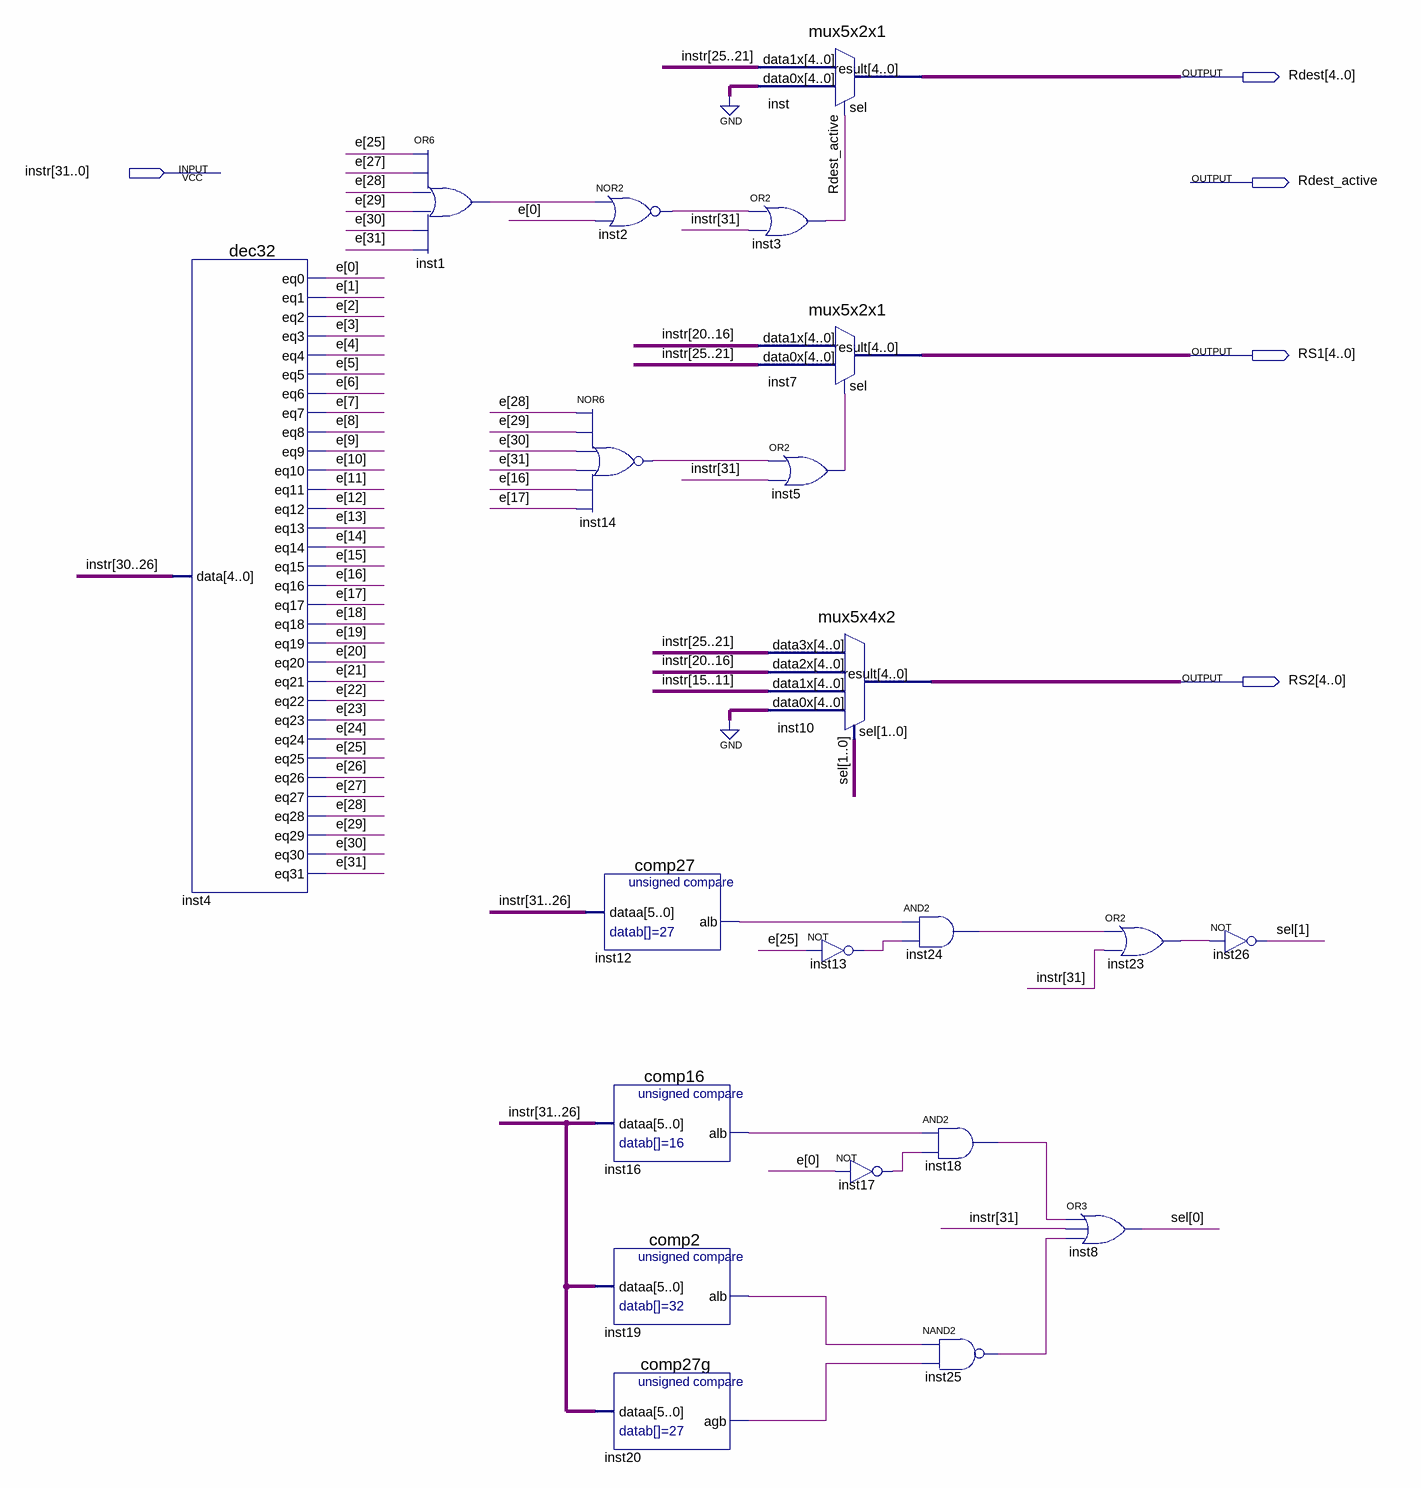
[diagram p0: schematic sheet]
// Quartus schematic RS_decode.bdf as structural Verilog: 21 symbols, 5 pins
module RS_decode (
  input  [31:0] instr,
  output [4:0] Rdest,
  output Rdest_active,
  output [4:0] RS1,
  output [4:0] RS2
);

  wire inst1_out, inst2_out, inst5_out, inst12_alb, inst13_out, inst14_out, inst16_alb, inst17_out,
       inst18_out, inst19_alb, inst20_agb, inst23_out, inst24_out, inst25_out;
  wire [1:0] sel;
  wire [31:0] e;

  dec32 inst4 (
    .data(instr[30:26]), .eq0(e[0]), .eq1(e[1]), .eq2(e[2]), .eq3(e[3]), .eq4(e[4]), .eq5(e[5]), .eq6(e[6]),
    .eq7(e[7]), .eq8(e[8]), .eq9(e[9]), .eq10(e[10]), .eq11(e[11]), .eq12(e[12]), .eq13(e[13]), .eq14(e[14]),
    .eq15(e[15]), .eq16(e[16]), .eq17(e[17]), .eq18(e[18]), .eq19(e[19]), .eq20(e[20]), .eq21(e[21]),
    .eq22(e[22]), .eq23(e[23]), .eq24(e[24]), .eq25(e[25]), .eq26(e[26]), .eq27(e[27]), .eq28(e[28]),
    .eq29(e[29]), .eq30(e[30]), .eq31(e[31]));
  or inst1 (inst1_out, e[25], e[27], e[28], e[29], e[30], e[31]);
  nor inst2 (inst2_out, inst1_out, e[0]);
  nor inst14 (inst14_out, e[28], e[29], e[30], e[31], e[16], e[17]);
  comp27 inst12 (.dataa(instr[31:26]), .alb(inst12_alb));
  comp16 inst16 (.dataa(instr[31:26]), .alb(inst16_alb));
  comp2 inst19 (.dataa(instr[31:26]), .alb(inst19_alb));
  comp27g inst20 (.dataa(instr[31:26]), .agb(inst20_agb));
  mux5x2x1 inst (.data1x(instr[25:21]), .data0x({5{1'b0}}), .sel(Rdest_active), .result(Rdest));
  or inst3 (Rdest_active, inst2_out, instr[31]);
  mux5x2x1 inst7 (.data1x(instr[20:16]), .data0x(instr[25:21]), .sel(inst5_out), .result(RS1));
  or inst5 (inst5_out, inst14_out, instr[31]);
  mux5x4x2 inst10 (
    .data3x(instr[25:21]), .data2x(instr[20:16]), .data1x(instr[15:11]), .data0x({5{1'b0}}), .sel(sel),
    .result(RS2));
  not inst13 (inst13_out, e[25]);
  not inst17 (inst17_out, e[0]);
  and inst24 (inst24_out, inst12_alb, inst13_out);
  and inst18 (inst18_out, inst16_alb, inst17_out);
  nand inst25 (inst25_out, inst19_alb, inst20_agb);
  or inst8 (sel[0], inst18_out, instr[31], inst25_out);
  or inst23 (inst23_out, inst24_out, instr[31]);
  not inst26 (sel[1], inst23_out);
endmodule
